# Altium schematic sheet power1.SchDoc
size A2
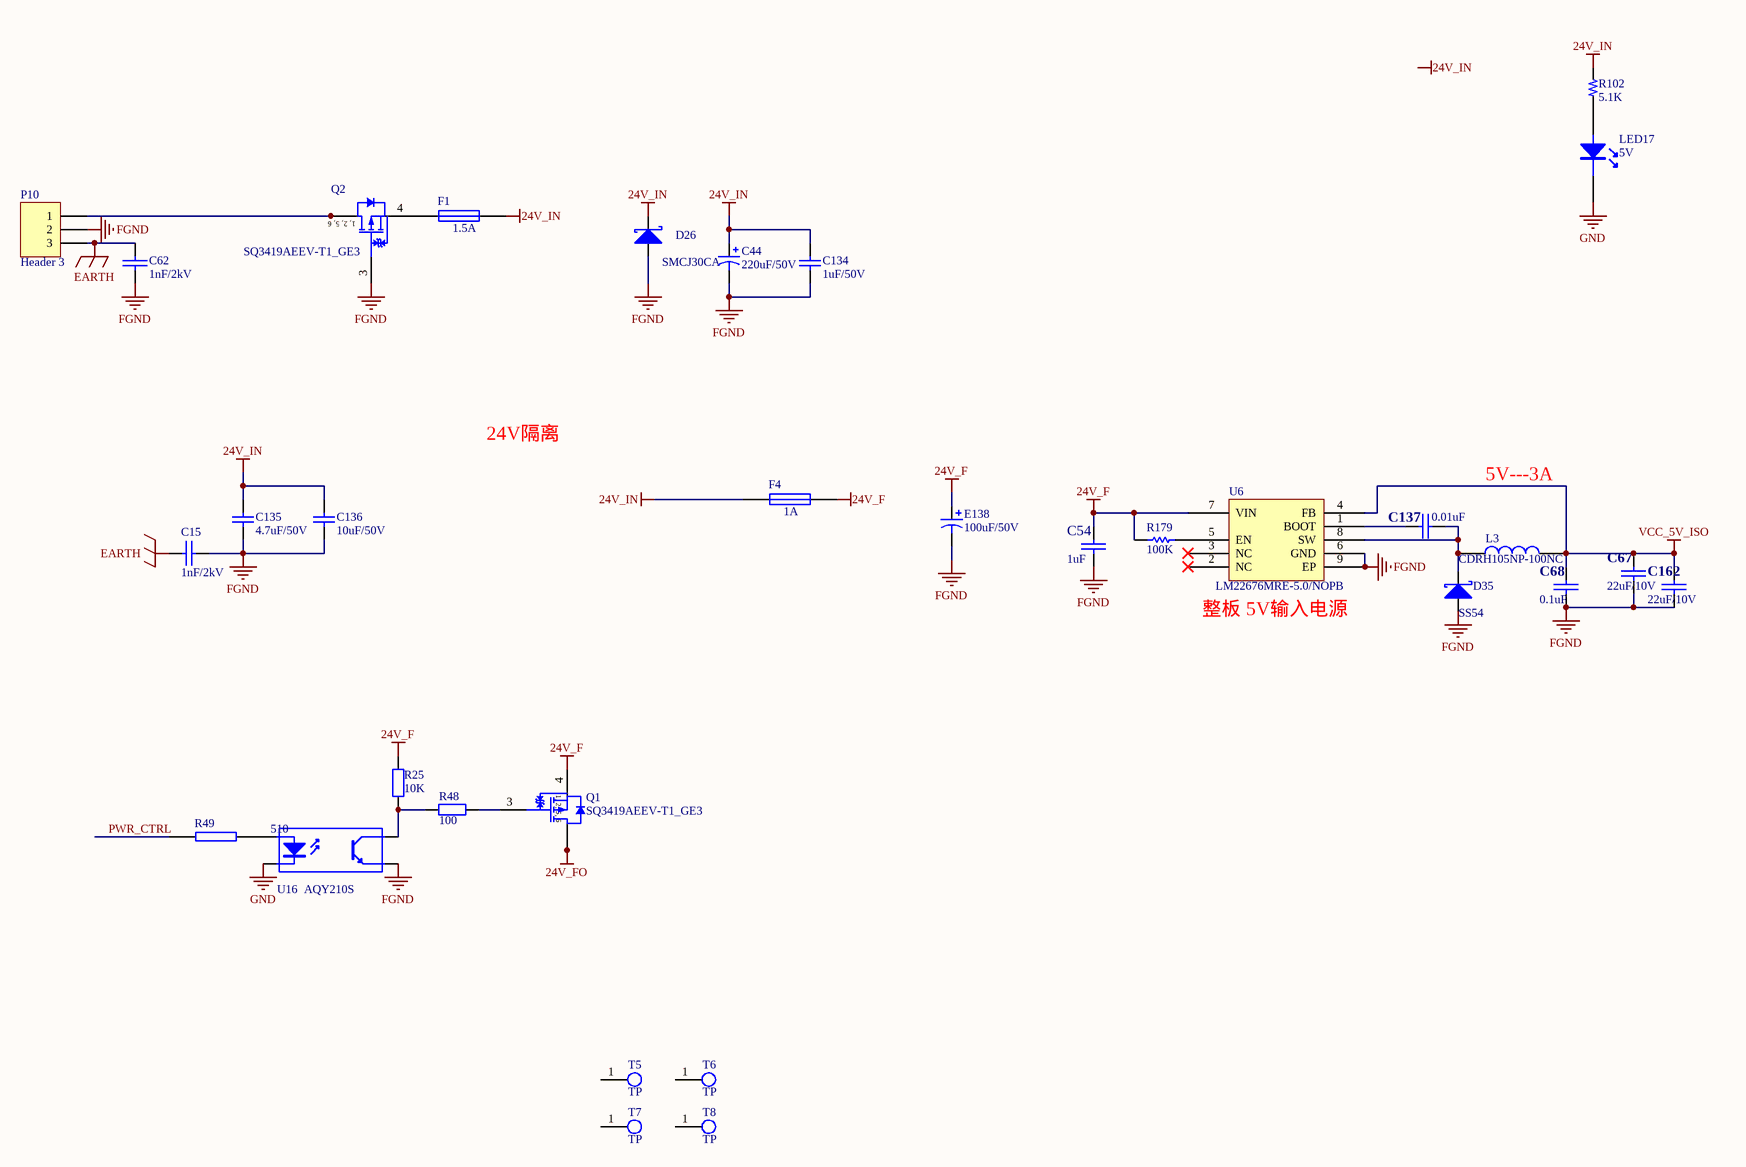
[diagram p0: power1.SchDoc]

## Parts
C15  1nF/2kV  [1206C]
C44  220uF/50V  [Φ10×10]
C54  1uF  [0603C]
C62  1nF/2kV  [1206C]
C67  22uF/10V  [1210C]
C68  0.1uF  [0603C]
C134  1uF/50V  [1210C]
C135  4.7uF/50V  [1210C]
C136  10uF/50V  [1210C]
C137  0.01uF  [0603C]
C162  22uF/10V  [1210C]
D26  SMCJ30CA  [SMC]
D35  SS54  [SMC]
E138  100uF/50V  [Φ10×10]
F1  1.5A  [1812-F]
F4  1A  [1812-F]
L3  CDRH105NP-100NC  [CDRH105]
LED17  5V  [0603LED]
P10  Header 3  [2ETYR-5.08-03P-14-100]
Q1  SQ3419AEEV-T1_GE3  [VISH-TSOP-6_V]
Q2  SQ3419AEEV-T1_GE3  [VISH-TSOP-6_V]
R25  10K  [0603R]
R48  100  [0603R]
R49  510  [0603R]
R102  5.1K  [0603R]
R179  100K  [0603R]
T5  TP  [m2.5]
T6  TP  [m2.5]
T7  TP  [m2.5]
T8  TP  [m2.5]
U6  LM22676MRE-5.0/NOPB  [SOP127P600X168_HS-8N]
U16  AQY210S  [sop4]

## Nets
24V_F: C54.2 E138.1 F4.2 Q1.4(S) R25.2 R179.2 U6.7(VIN)
24V_FO: Q1.1(D) Q1.2(D) Q1.5(D) Q1.6(D)
24V_IN: C44.1 C134.2 C135.2 C136.2 D26.2(K) F1.2 F4.1 R102.2
EARTH: C15.2 C62.2 P10.3
FGND: C15.1 C44.2 C54.1 C62.1 C67.2 C68.2 C134.1 C135.1 C136.1 C162.2 D26.1(A) D35.1(A) E138.2 P10.2 Q2.3(G) U6.6(GND) U6.9(EP) U16.3(E)
GND: LED17.2 U16.2(K)
VCC_5V_ISO: C67.1 C68.1 C162.1 L3.2 U6.4(FB)
PWR_CTRL: R49.2
NetC137_1: C137.1 D35.2(K) L3.1 U6.8(SW)
NetC137_2: C137.2 U6.1(BOOT)
NetF1_1: F1.1 Q2.4(S)
NetLED17_1: LED17.1 R102.1
NetP10_1: P10.1 Q2.1(D) Q2.2(D) Q2.5(D) Q2.6(D)
NetQ1_3: Q1.3(G) R48.1
NetR25_1: R25.1 R48.2 U16.4(C)
NetR49_1: R49.1 U16.1(A)
NetR179_1: R179.1 U6.5(EN)

Not connected (* = marked no-connect by the designer): T5 1; T6 1; T7 1; T8 1; U6 2(NC)* 3(NC)*

## Notes on the sheet
- 24V隔离
- 5V---3A
- (near U6) 整板 5V输入电源
- Labels drawn without touching a wire or pin: 24V_IN
- (in symbol SQ3419AEEV-T1_GE3) 1, 2, 5, 6

## Library data of the parts
C15 C54 C62 C67 C68 C137 C162 = CAP: Capacitor
C44 = Cap Pol1: Polarized Capacitor (Radial); Published: 8-Jun-2000; LatestRevisionDate: 17-Jul-2002; LatestRevisionNote: Re-released for DXP Platform.; PackageReference: RB7.6-15; Publisher: Altium Limited; Value: 220uF/50V
C134-C136 = Cap: Capacitor; Value: 22nF; Published: 8-Jun-2000; LatestRevisionDate: 17-Jul-2002; LatestRevisionNote: Re-released for DXP Platform.; PackageReference: RAD-0.3; Publisher: Altium Limited; PackageDescription: Radial Cap, Thru-Hole; 2 Leads; 0.3 in Pin Spacing
D26 D35 = DIODE S: Schottky Diode
E138 = Cap Pol1: Polarized Capacitor (Radial); Value: 100pF; Published: 8-Jun-2000; LatestRevisionDate: 17-Jul-2002; LatestRevisionNote: Re-released for DXP Platform.; PackageReference: RB7.6-15; Publisher: Altium Limited
F1 F4 = Fuse 1: Fuse; Published: 8-Jun-2000; LatestRevisionDate: 17-Jul-2002; LatestRevisionNote: Re-released for DXP Platform.; PackageReference: PIN-W2/E2.8; Publisher: Altium Limited; PackageDescription: Thru-Hole; 2 Leads
L3 = INDUCTOR
LED17 = LED
P10 = Header 3: Header, 3-Pin; LatestRevisionDate: 17-Jul-2002; LatestRevisionNote: Re-released for DXP Platform.; Publisher: Altium Limited
Q1 Q2 = SQ3419AEEV-T1_GE3: Automotive P-Channel MOSFET, 6.9 A, 40 V, -55 to 175 degC, 6-Pin TSOP, RoHS, Tape and Reel; Manufacturer: International Rectifier; Rated Power Dissipation: 2W; Qg Gate Charge: 25nC; Drain-to-Source Voltage [Vdss]: 40V; Drain-Source On Resistance-Max: 112mO; Channel Type: P-Channel; Package Description: 6-Pin Thin Small Outline Package, Body 3 x 1.65 mm, Pitch 1.00 mm; Datasheet URL: https://www.vishay.com/docs/65332/sq3419aeev.pdf; Mounting Technology: SurfaceMount; Package Reference: TSOP-6; Manufacturer URL: https://www.vishay.com/; Datasheet Version: 04/2010
R25 R48 = Res0805M
R49 = RES2
R102 = R
R179 = Res1: Resistor; Published: 8-Jun-2000; LatestRevisionDate: 17-Jul-2002; LatestRevisionNote: Re-released for DXP Platform.; PackageReference: AXIAL-0.3; Publisher: Altium Limited
U6 = LM22676MR-5.0
U16 = Optoisolator1: 4-Pin Phototransistor Optocoupler; Published: 24-Mar-1999; LatestRevisionDate: 04-Mar-2005; LatestRevisionNote: Sch pins 3 & 4 Swapped.; DatasheetVersion: Nov-2003; PackageReference: DIP-4; Publisher: Altium Limited